# Altium schematic sheet LED_Readout_Termination_Resistors.SchDoc
size A
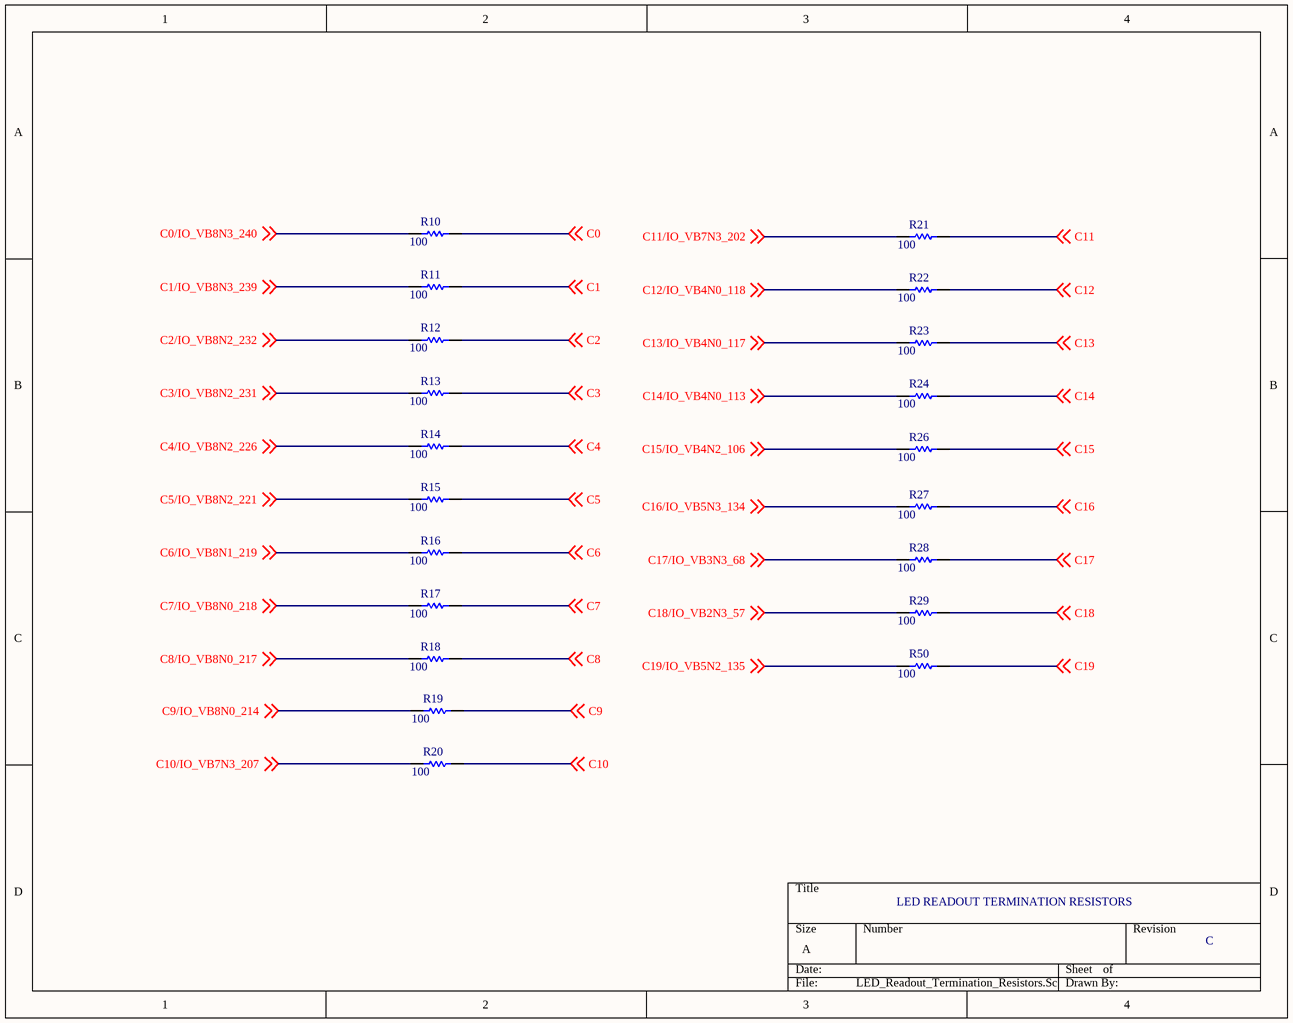
[diagram p0: LED_Readout_Termination_Resistors.SchDoc]

## Parts
R10  value 100  [RES_0603]  (hidden comment: Figure out ohmage after RevA)
R11  value 100  [RES_0603]  (hidden comment: Figure out ohmage after RevA)
R12  value 100  [RES_0603]  (hidden comment: Figure out ohmage after RevA)
R13  value 100  [RES_0603]  (hidden comment: Figure out ohmage after RevA)
R14  value 100  [RES_0603]  (hidden comment: Figure out ohmage after RevA)
R15  value 100  [RES_0603]  (hidden comment: Figure out ohmage after RevA)
R16  value 100  [RES_0603]  (hidden comment: Figure out ohmage after RevA)
R17  value 100  [RES_0603]  (hidden comment: Figure out ohmage after RevA)
R18  value 100  [RES_0603]  (hidden comment: Figure out ohmage after RevA)
R19  value 100  [RES_0603]  (hidden comment: Figure out ohmage after RevA)
R20  value 100  [RES_0603]  (hidden comment: Figure out ohmage after RevA)
R21  value 100  [RES_0603]  (hidden comment: Figure out ohmage after RevA)
R22  value 100  [RES_0603]  (hidden comment: Figure out ohmage after RevA)
R23  value 100  [RES_0603]  (hidden comment: Figure out ohmage after RevA)
R24  value 100  [RES_0603]  (hidden comment: Figure out ohmage after RevA)
R26  value 100  [RES_0603]  (hidden comment: Figure out ohmage after RevA)
R27  value 100  [RES_0603]  (hidden comment: Figure out ohmage after RevA)
R28  value 100  [RES_0603]  (hidden comment: Figure out ohmage after RevA)
R29  value 100  [RES_0603]  (hidden comment: Figure out ohmage after RevA)
R50  value 100  [RES_0603]  (hidden comment: Figure out ohmage after RevA)

## Nets
C0: R10.2 ; off-sheet C0
C0/IO_VB8N3_240: R10.1 ; off-sheet C0/IO_VB8N3_240
C1: R11.2 ; off-sheet C1
C1/IO_VB8N3_239: R11.1 ; off-sheet C1/IO_VB8N3_239
C2: R12.2 ; off-sheet C2
C2/IO_VB8N2_232: R12.1 ; off-sheet C2/IO_VB8N2_232
C3: R13.2 ; off-sheet C3
C3/IO_VB8N2_231: R13.1 ; off-sheet C3/IO_VB8N2_231
C4: R14.2 ; off-sheet C4
C4/IO_VB8N2_226: R14.1 ; off-sheet C4/IO_VB8N2_226
C5: R15.2 ; off-sheet C5
C5/IO_VB8N2_221: R15.1 ; off-sheet C5/IO_VB8N2_221
C6: R16.2 ; off-sheet C6
C6/IO_VB8N1_219: R16.1 ; off-sheet C6/IO_VB8N1_219
C7: R17.2 ; off-sheet C7
C7/IO_VB8N0_218: R17.1 ; off-sheet C7/IO_VB8N0_218
C8: R18.2 ; off-sheet C8
C8/IO_VB8N0_217: R18.1 ; off-sheet C8/IO_VB8N0_217
C9: R19.2 ; off-sheet C9
C9/IO_VB8N0_214: R19.1 ; off-sheet C9/IO_VB8N0_214
C10: R20.2 ; off-sheet C10
C10/IO_VB7N3_207: R20.1 ; off-sheet C10/IO_VB7N3_207
C11: R21.2 ; off-sheet C11
C11/IO_VB7N3_202: R21.1 ; off-sheet C11/IO_VB7N3_202
C12: R22.2 ; off-sheet C12
C12/IO_VB4N0_118: R22.1 ; off-sheet C12/IO_VB4N0_118
C13: R23.2 ; off-sheet C13
C13/IO_VB4N0_117: R23.1 ; off-sheet C13/IO_VB4N0_117
C14: R24.2 ; off-sheet C14
C14/IO_VB4N0_113: R24.1 ; off-sheet C14/IO_VB4N0_113
C15: R26.2 ; off-sheet C15
C15/IO_VB4N2_106: R26.1 ; off-sheet C15/IO_VB4N2_106
C16: R27.2 ; off-sheet C16
C16/IO_VB5N3_134: R27.1 ; off-sheet C16/IO_VB5N3_134
C17: R28.2 ; off-sheet C17
C17/IO_VB3N3_68: R28.1 ; off-sheet C17/IO_VB3N3_68
C18: R29.2 ; off-sheet C18
C18/IO_VB2N3_57: R29.1 ; off-sheet C18/IO_VB2N3_57
C19: R50.2 ; off-sheet C19
C19/IO_VB5N2_135: R50.1 ; off-sheet C19/IO_VB5N2_135

## Notes on the sheet
- LED READOUT TERMINATION RESISTORS
- C

## Library data of the parts
R10-R24 R26-R29 R50 = Res1: Resistor; Published: 8-Jun-2000; LatestRevisionDate: 17-Jul-2002; LatestRevisionNote: Re-released for DXP Platform.; PackageReference: AXIAL-0.3; Publisher: Altium Limited; PackageDescription: Axial Device, Thru-Hole; 2 Leads; 0.3 in Pin Spacing